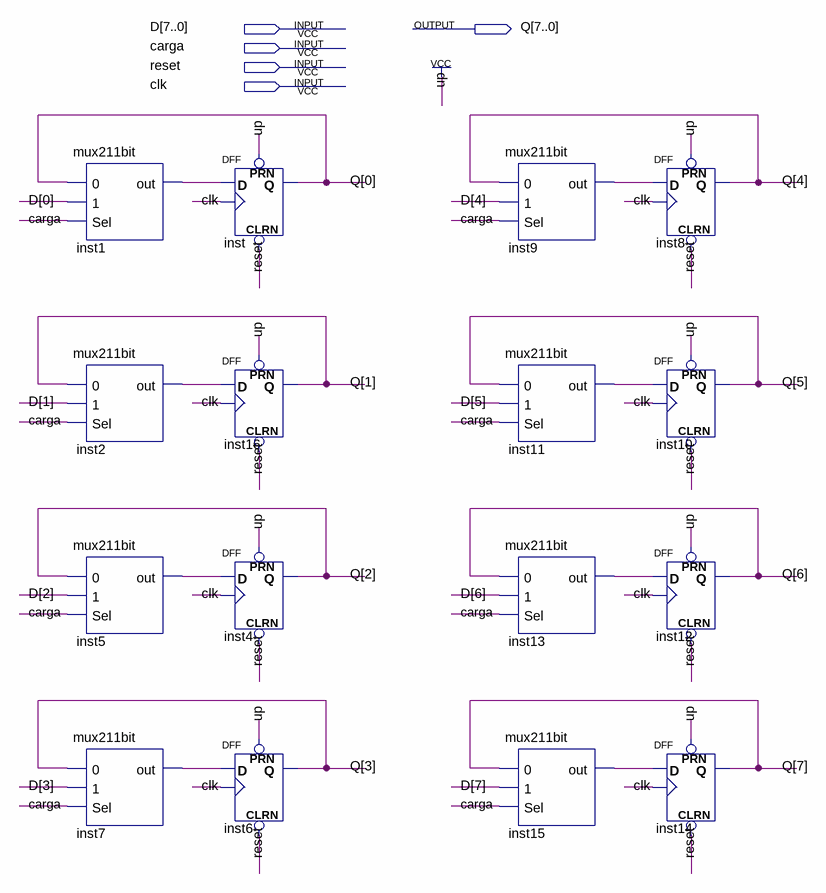
[diagram p0: schematic sheet]
// Quartus schematic reg8.bdf as structural Verilog: 16 symbols, 5 pins
module reg8 (
  input  [7:0] D,
  input  carga,
  input  reset,
  input  clk,
  output [7:0] Q
);

  wire inst1_out, inst2_out, inst5_out, inst7_out, inst9_out, inst11_out, inst13_out, inst15_out;

  mux211bit inst1 (.\0 (Q[0]), .\1 (D[0]), .Sel(carga), .out(inst1_out));
  mux211bit inst2 (.\0 (Q[1]), .\1 (D[1]), .Sel(carga), .out(inst2_out));
  mux211bit inst5 (.\0 (Q[2]), .\1 (D[2]), .Sel(carga), .out(inst5_out));
  mux211bit inst7 (.\0 (Q[3]), .\1 (D[3]), .Sel(carga), .out(inst7_out));
  DFF inst (.CLRN(reset), .CLK(clk), .D(inst1_out), .PRN(1'b1), .Q(Q[0]));
  DFF inst16 (.CLRN(reset), .CLK(clk), .D(inst2_out), .PRN(1'b1), .Q(Q[1]));
  DFF inst4 (.CLRN(reset), .CLK(clk), .D(inst5_out), .PRN(1'b1), .Q(Q[2]));
  DFF inst6 (.CLRN(reset), .CLK(clk), .D(inst7_out), .PRN(1'b1), .Q(Q[3]));
  mux211bit inst9 (.\0 (Q[4]), .\1 (D[4]), .Sel(carga), .out(inst9_out));
  mux211bit inst11 (.\0 (Q[5]), .\1 (D[5]), .Sel(carga), .out(inst11_out));
  mux211bit inst13 (.\0 (Q[6]), .\1 (D[6]), .Sel(carga), .out(inst13_out));
  mux211bit inst15 (.\0 (Q[7]), .\1 (D[7]), .Sel(carga), .out(inst15_out));
  DFF inst8 (.CLRN(reset), .CLK(clk), .D(inst9_out), .PRN(1'b1), .Q(Q[4]));
  DFF inst10 (.CLRN(reset), .CLK(clk), .D(inst11_out), .PRN(1'b1), .Q(Q[5]));
  DFF inst12 (.CLRN(reset), .CLK(clk), .D(inst13_out), .PRN(1'b1), .Q(Q[6]));
  DFF inst14 (.CLRN(reset), .CLK(clk), .D(inst15_out), .PRN(1'b1), .Q(Q[7]));
endmodule
